# EAGLE design Motorcontroller (EAGLE 9.2.0)
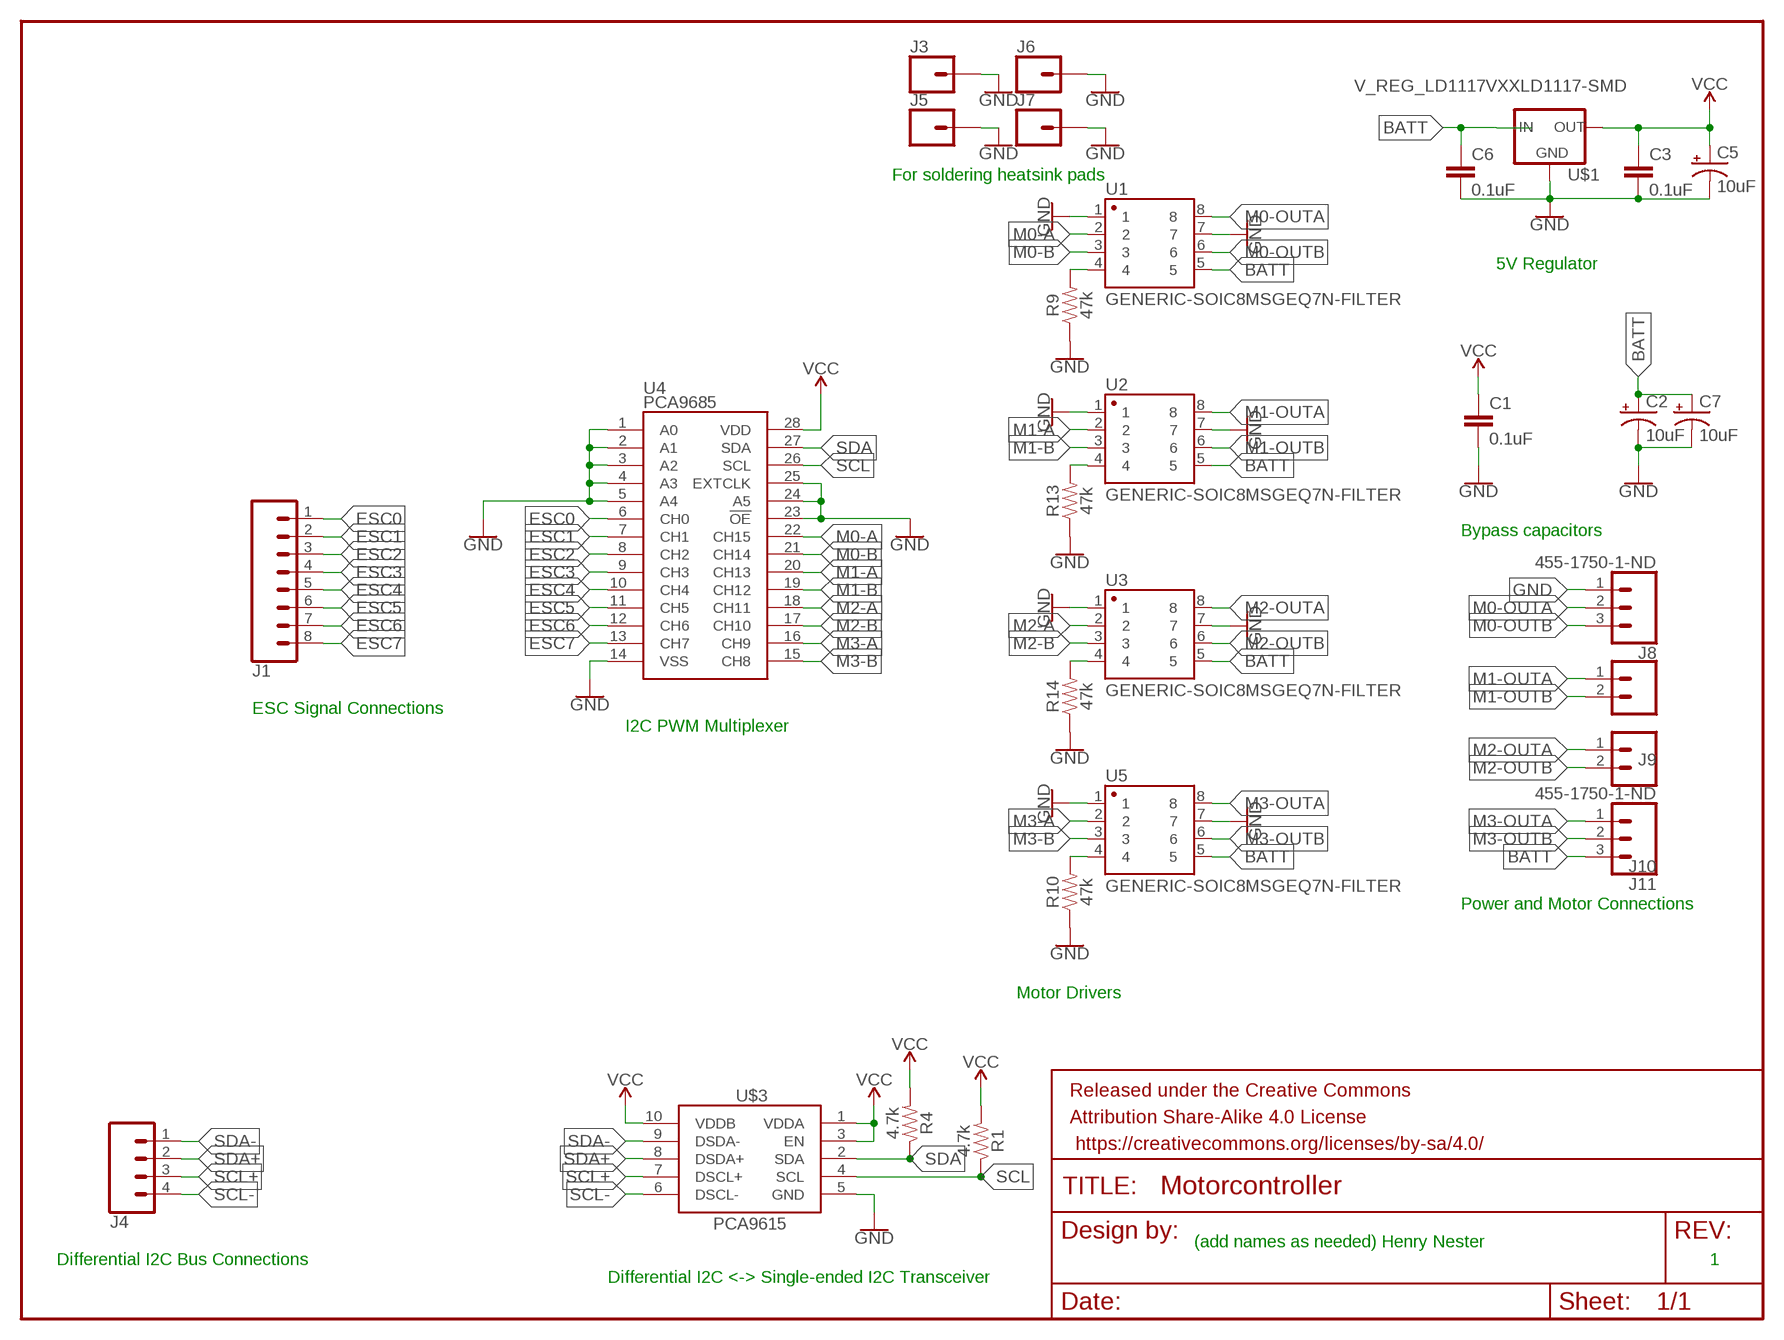
[diagram p0: schematic, sheet 1]

## Parts
C1  0.1uF  0.1UF-0603-25V-(+80/-20%)  [0603]
C2  10uF  10UF-POLAR-RADIAL-2.5MM-25V-20%  [CPOL-RADIAL-2.5MM-5MM]
C3  0.1uF  0.1UF-0603-25V-(+80/-20%)  [0603]
C5  10uF  10UF-POLAR-RADIAL-2.5MM-25V-20%  [CPOL-RADIAL-2.5MM-5MM]
C6  0.1uF  0.1UF-0603-25V-(+80/-20%)  [0603]
C7  10uF  10UF-POLAR-RADIAL-2.5MM-25V-20%  [CPOL-RADIAL-2.5MM-5MM]
FRAME1  FRAME-LETTERNO_PACKAGE  [DUMMY]
J1  CONN_08"  [1X08]
J3  CONN_01PTH_NO_SILK_YES_STOP  [1X01_NO_SILK]
J4  CONN_04  [1X04]
J5  CONN_01PTH_NO_SILK_YES_STOP  [1X01_NO_SILK]
J6  CONN_01PTH_NO_SILK_YES_STOP  [1X01_NO_SILK]
J7  CONN_01PTH_NO_SILK_YES_STOP  [1X01_NO_SILK]
J8  455-1750-1-ND  CONN_03  [1X03]
J9  CONN_02  [1X02]
J10  CONN_02  [1X02]
J11  455-1750-1-ND  CONN_03  [1X03]
R1  4.7k  4.7KOHM-0603-1/10W-1%  [0603]
R4  4.7k  4.7KOHM-0603-1/10W-1%  [0603]
R9  47k  47KOHM-0603-1/10W-1%  [0603]
R10  47k  47KOHM-0603-1/10W-1%  [0603]
R13  47k  47KOHM-0603-1/10W-1%  [0603]
R14  47k  47KOHM-0603-1/10W-1%  [0603]
U1  GENERIC-SOIC8MSGEQ7N-FILTER  [SO08]
U2  GENERIC-SOIC8MSGEQ7N-FILTER  [SO08]
U3  GENERIC-SOIC8MSGEQ7N-FILTER  [SO08]
U4  PCA9685  [TSSOP-28_4MM]
U5  GENERIC-SOIC8MSGEQ7N-FILTER  [SO08]
U$1  V_REG_LD1117VXXLD1117-SMD  [SOT223]
U$3  PCA9615  [TSSOP10]

## Nets
BATT: C2.1(+) C6.1 C7.1(+) J11.3 U1.5 U2.5 U3.5 U5.5 U$1.3(IN)
ESC0: J1.1 U4.6(CH0)
ESC1: J1.2 U4.7(CH1)
ESC2: J1.3 U4.8(CH2)
ESC3: J1.4 U4.9(CH3)
ESC4: J1.5 U4.10(CH4)
ESC5: J1.6 U4.11(CH5)
ESC6: J1.7 U4.12(CH6)
ESC7: J1.8 U4.13(CH7)
GND: C1.2 C2.2(-) C3.2 C5.2(-) C6.2 C7.2(-) J3.1 J5.1 J6.1 J7.1 J8.1 R9.1 R10.1 R13.1 R14.1 U1.1 U1.7 U2.1 U2.7 U3.1 U3.7 U4.1(A0) U4.2(A1) U4.3(A2) U4.4(A3) U4.5(A4) U4.14(VSS) U4.23(!OE) U4.24(A5) U4.25(EXTCLK) U5.1 U5.7 U$1.1(GND) U$3.5(GND)
M0-A: U1.2 U4.22(CH15)
M0-B: U1.3 U4.21(CH14)
M0-OUTA: J8.2 U1.8
M0-OUTB: J8.3 U1.6
M1-A: U2.2 U4.20(CH13)
M1-B: U2.3 U4.19(CH12)
M1-OUTA: J9.1 U2.8
M1-OUTB: J9.2 U2.6
M2-A: U3.2 U4.18(CH11)
M2-B: U3.3 U4.17(CH10)
M2-OUTA: J10.1 U3.8
M2-OUTB: J10.2 U3.6
M3-A: U4.16(CH9) U5.2
M3-B: U4.15(CH8) U5.3
M3-OUTA: J11.1 U5.8
M3-OUTB: J11.2 U5.6
N$1: R13.2 U2.4
N$2: R14.2 U3.4
N$3: R10.2 U5.4
N$7: R9.2 U1.4
SCL: R1.1 U4.26(SCL) U$3.4(SCL)
SCL+: J4.3 U$3.7(DSCL+)
SCL-: J4.4 U$3.6(DSCL-)
SDA: R4.1 U4.27(SDA) U$3.2(SDA)
SDA+: J4.2 U$3.8(DSDA+)
SDA-: J4.1 U$3.9(DSDA-)
VCC: C1.1 C3.1 C5.1(+) R1.2 R4.2 U4.28(VDD) U$1.2(OUT) U$3.1(VDDA) U$3.3(EN) U$3.10(VDDB)

## Notes on the sheet
- For soldering heatsink pads
- 5V Regulator
- Bypass capacitors
- ESC Signal Connections
- I2C PWM Multiplexer
- Power and Motor Connections
- Motor Drivers
- (add names as needed) Henry Nester
- Differential I2C Bus Connections | 1
- Differential I2C <-> Single-ended I2C Transceiver

## Library data of the parts
C1 C3 C6 = SparkFun-Capacitors:0.1UF: 0.1µF ceramic capacitors A capacitor is a passive two-terminal electrical component used to store electrical energy temporarily in an electric field.; PROD_ID: CAP-00810
C2 C5 C7 = SparkFun-Capacitors:10UF-POLAR: 10.0µF polarized capacitors A capacitor is a passive two-terminal electrical component used to store electrical energy temporarily in an electric field.; PROD_ID: CAP-08440
FRAME1 = SparkFun-Aesthetics:FRAME-LETTER: Schematic Frame - Letter Standard 8.5x11 US Letter frame; DESIGNER: Nobody; VERSION: v01
J1 = SparkFun-Connectors:CONN_08: Multi connection point. Often used as Generic Header-pin footprint for 0.1 inch spaced/style header connections On any of the 0.1 inch spaced packages, you can populate with these: Break Away Headers - Straight <https://www.sparkfun.com/products/116> (PRT-00116) Break Away Male Headers - Right Angle <https://www.sparkfun.com/products/553> (PRT-00553) Female Headers <https://www.sparkfun.com/products/115> (PRT-00115) Break Away Headers - Machine Pin <https://www.sparkfun.com/products/117> (PRT-00117) Break Away Female Headers - Swiss Machine Pin <https://www.sparkfun.com/products/743> (PRT-00743) Arduino Stackable Header - 8 Pin <https://www.sparkfun.com/products/9279> (PRT-09279) For SCREWTERMINALS and SPRING TERMINALS visit here: Screw Terimnals on SparkFun.com <https://www.sparkfun.com/search/results?term=Screw+Terminals> (5mm/3.5mm/2.54mm spacing) This device is also useful as a general connection point to wire up your design to another part of your project. Our various solder wires solder well into these plated through hole pads. Hook-Up Wire - Assortment (Stranded, 22 AWG) <https://www.sparkfun.com/products/11375> (PRT-11375) Hook-Up Wire - Assortment (Solid Core, 22 AWG) <https://www.sparkfun.com/products/11367> (PRT-11367) View the entire wire category on our website here <https://www.sparkfun.com/categories/141> Special notes: Molex polarized connector foot print use with SKU : PRT-08231 with associated crimp pins and housings. 1MM SMD Version SKU: PRT-10208 NOTES ON THE VARIANTS LOCK and LOCK_LONGPADS... This footprint was designed to help hold the alignment of a through-hole component (i.e. 6-pin header) while soldering it into place. You may notice that each hole has been shifted either up or down by 0.005 of an inch from it's more standard position (which is a perfectly straight line). This slight alteration caused the pins (the squares in the middle) to touch the edges of the holes. Because they are alternating, it causes a "brace" to hold the component in place. 0.005 has proven to be the perfect amount of "off-center" position when using our standard breakaway headers. Although looks a little odd when you look at the bare footprint, once you have a header in there, the alteration is very hard to notice. Also,if you push a header all the way into place, it is covered up entirely on the bottom side.; PROD_ID: CONN-08438
J3 J5-J7 = SparkFun-Connectors:CONN_01: Single connection point. Often used as Generic Header-pin footprint for 0.1 inch spaced/style header connections On any of the 0.1 inch spaced packages, you can populate with these: Break Away Headers - Straight <https://www.sparkfun.com/products/116> (PRT-00116) Break Away Male Headers - Right Angle <https://www.sparkfun.com/products/553> (PRT-00553) Female Headers <https://www.sparkfun.com/products/115> (PRT-00115) Break Away Headers - Machine Pin <https://www.sparkfun.com/products/117> (PRT-00117) Break Away Female Headers - Swiss Machine Pin <https://www.sparkfun.com/products/743> (PRT-00743) This device is also useful as a general connection point to wire up your design to another part of your project. Our various solder wires solder well into these plated through hole pads. Hook-Up Wire - Assortment (Stranded, 22 AWG) <https://www.sparkfun.com/products/11375> (PRT-11375) Hook-Up Wire - Assortment (Solid Core, 22 AWG) <https://www.sparkfun.com/products/11367> (PRT-11367) View the entire wire category on our website here <https://www.sparkfun.com/categories/141> Special notes: SMTSO-256-ET is a "flush mount" nut for a 4-40 screw. We mostly use this on specialty testbeds; it is a nice way to connect hardware to your PCB at an adjustable hieght. Also note, the SNAP packages are for using a snappable style connector. We sell a baggie of snaps and they are also used on two LilyPad designs: Snap Assortment - 30 pack (male and female) <https://www.sparkfun.com/products/11347> (DEV-11347) LilyPad Arduino SimpleSnap <https://www.sparkfun.com/products/10941> (DEV-10941) LilyPad SimpleSnap Protoboard <https://www.sparkfun.com/products/10940> (DEV-10940)
J4 = SparkFun-Connectors:CONN_04: Multi connection point. Often used as Generic Header-pin footprint for 0.1 inch spaced/style header connections On any of the 0.1 inch spaced packages, you can populate with these: Break Away Headers - Straight <https://www.sparkfun.com/products/116> (PRT-00116) Break Away Male Headers - Right Angle <https://www.sparkfun.com/products/553> (PRT-00553) Female Headers <https://www.sparkfun.com/products/115> (PRT-00115) Break Away Headers - Machine Pin <https://www.sparkfun.com/products/117> (PRT-00117) Break Away Female Headers - Swiss Machine Pin <https://www.sparkfun.com/products/743> (PRT-00743) For SCREWTERMINALS and SPRING TERMINALS visit here: Screw Terimnals on SparkFun.com <https://www.sparkfun.com/search/results?term=Screw+Terminals> (5mm/3.5mm/2.54mm spacing) This device is also useful as a general connection point to wire up your design to another part of your project. Our various solder wires solder well into these plated through hole pads. Hook-Up Wire - Assortment (Stranded, 22 AWG) <https://www.sparkfun.com/products/11375> (PRT-11375) Hook-Up Wire - Assortment (Solid Core, 22 AWG) <https://www.sparkfun.com/products/11367> (PRT-11367) View the entire wire category on our website here <https://www.sparkfun.com/categories/141> Special notes: Molex polarized connector foot print use with SKU : PRT-08231 with associated crimp pins and housings. 1MM SMD Version SKU: PRT-10208; PROD_ID: CONN-09696
J8 J11 = SparkFun-Connectors:CONN_03: Multi connection point. Often used as Generic Header-pin footprint for 0.1 inch spaced/style header connections On any of the 0.1 inch spaced packages, you can populate with these: Break Away Headers - Straight <https://www.sparkfun.com/products/116> (PRT-00116) Break Away Male Headers - Right Angle <https://www.sparkfun.com/products/553> (PRT-00553) Female Headers <https://www.sparkfun.com/products/115> (PRT-00115) Break Away Headers - Machine Pin <https://www.sparkfun.com/products/117> (PRT-00117) Break Away Female Headers - Swiss Machine Pin <https://www.sparkfun.com/products/743> (PRT-00743) Stackable Header - 3 Pin (Female, 0.1") <https://www.sparkfun.com/products/13875> (PRT-13875) For SCREWTERMINALS and SPRING TERMINALS visit here: Screw Terimnals on SparkFun.com <https://www.sparkfun.com/search/results?term=Screw+Terminals> (5mm/3.5mm/2.54mm spacing) This device is also useful as a general connection point to wire up your design to another part of your project. Our various solder wires solder well into these plated through hole pads. Hook-Up Wire - Assortment (Stranded, 22 AWG) <https://www.sparkfun.com/products/11375> (PRT-11375) Hook-Up Wire - Assortment (Solid Core, 22 AWG) <https://www.sparkfun.com/products/11367> (PRT-11367) View the entire wire category on our website here <https://www.sparkfun.com/categories/141> Special notes: Molex polarized connector foot print use with SKU : PRT-08232 with associated crimp pins and housings.; PROD_ID: XXX-00000
J9 J10 = SparkFun-Connectors:CONN_02: Multi connection point. Often used as Generic Header-pin footprint for 0.1 inch spaced/style header connections On any of the 0.1 inch spaced packages, you can populate with these: Break Away Headers - Straight <https://www.sparkfun.com/products/116> (PRT-00116) Break Away Male Headers - Right Angle <https://www.sparkfun.com/products/553> (PRT-00553) Female Headers <https://www.sparkfun.com/products/115> (PRT-00115) Break Away Headers - Machine Pin <https://www.sparkfun.com/products/117> (PRT-00117) Break Away Female Headers - Swiss Machine Pin <https://www.sparkfun.com/products/743> (PRT-00743) For SCREWTERMINALS and SPRING TERMINALS visit here: Screw Terimnals on SparkFun.com <https://www.sparkfun.com/search/results?term=Screw+Terminals> (5mm/3.5mm/2.54mm spacing) This device is also useful as a general connection point to wire up your design to another part of your project. Our various solder wires solder well into these plated through hole pads. Hook-Up Wire - Assortment (Stranded, 22 AWG) <https://www.sparkfun.com/products/11375> (PRT-11375) Hook-Up Wire - Assortment (Solid Core, 22 AWG) <https://www.sparkfun.com/products/11367> (PRT-11367) View the entire wire category on our website here <https://www.sparkfun.com/categories/141> Special notes: Molex polarized connector foot print use with: PRT-08233 with associated crimp pins and housings. 2.54_SCREWTERM for use with PRT-10571. 3.5mm Screw Terminal footprints for PRT-08084 5mm Screw Terminal footprints for use with PRT-08432
R1 R4 = SparkFun-Resistors:4.7KOHM: 4.7kΩ resistor A resistor is a passive two-terminal electrical component that implements electrical resistance as a circuit element. Resistors act to reduce current flow, and, at the same time, act to lower voltage levels within circuits. - Wikipedia; PROD_ID: RES-07857
R9 R10 R13 R14 = SparkFun-Resistors:47KOHM: 47kΩ resistor A resistor is a passive two-terminal electrical component that implements electrical resistance as a circuit element. Resistors act to reduce current flow, and, at the same time, act to lower voltage levels within circuits. - Wikipedia; PROD_ID: RES-07871
U1-U3 U5 = SparkFun-Retired:GENERIC-SOIC8: A placeholder for generic narrow & wide SOIC8 foorptints - used on the DIP adapter board. Has strange reference to IC-10141, a Seven Band Graphic Equalizer Display Filter SOIC-8 VFP: IC-10141; PROD_ID: IC-10141
U4 = SparkFun-IC-Special-Function:PCA9685: 16-channel 12-bit PWM I2C interface Internal Oscillator 40Hz to 1kHz Can be totem pole or open collector 2.3V to 5.5V SparkFun Products SparkFun Block for Intel® Edison - PWM <https://www.sparkfun.com/products/13042> (DEV-13042) PROTO: IC-12240 PROD_ID: IC-12271; PROD_ID: IC-12271
U$1 = SparkFun-IC-Power:V_REG_LD1117VXX: LD1117VXX voltage regulator. We carry the 3.3V version (COM-00526) in TO-220 package.; PROD_ID: VREG-13917
U$3 = SparkFun-IC-Comms:PCA9615: Differential I2C Bus Buffer Datasheet <https://www.nxp.com/docs/en/data-sheet/PCA9615.pdf>; PROD_ID: IC-13899

## Board
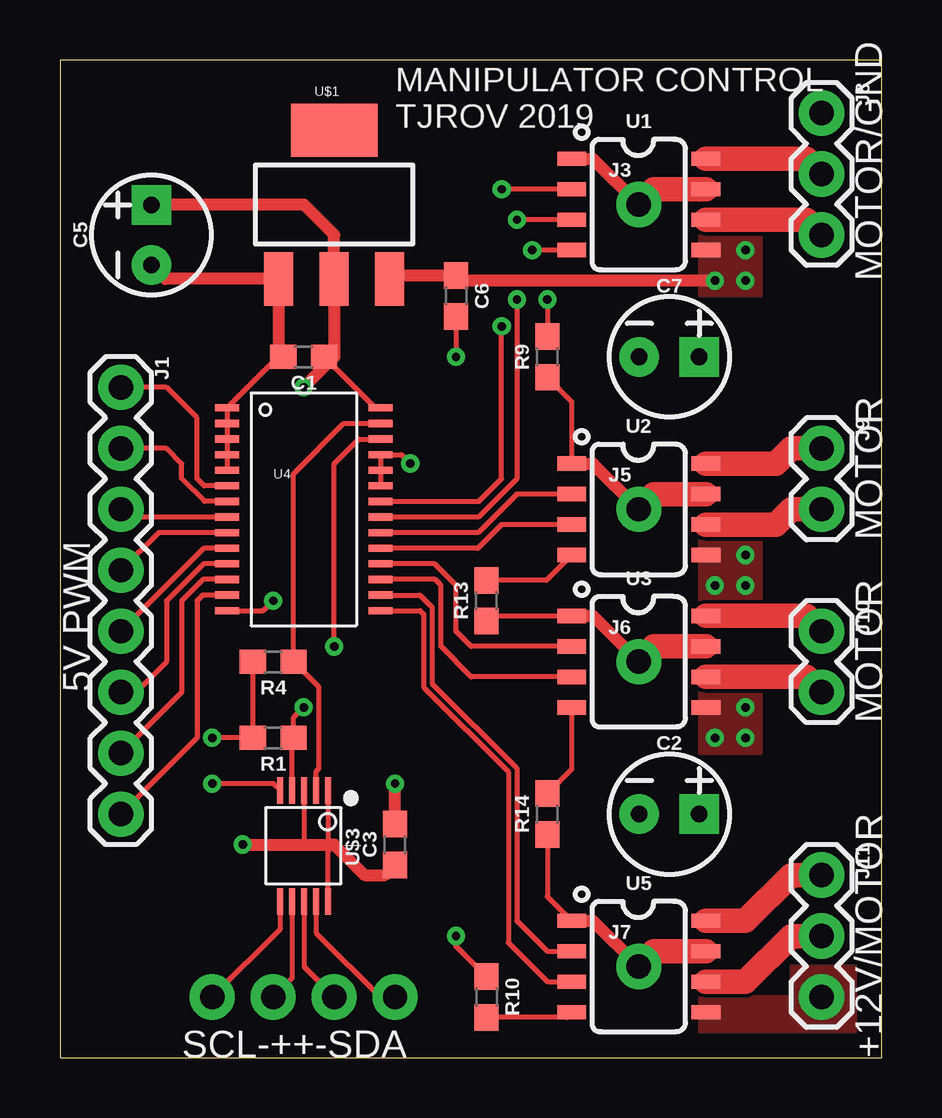
[diagram p1: board, top side]
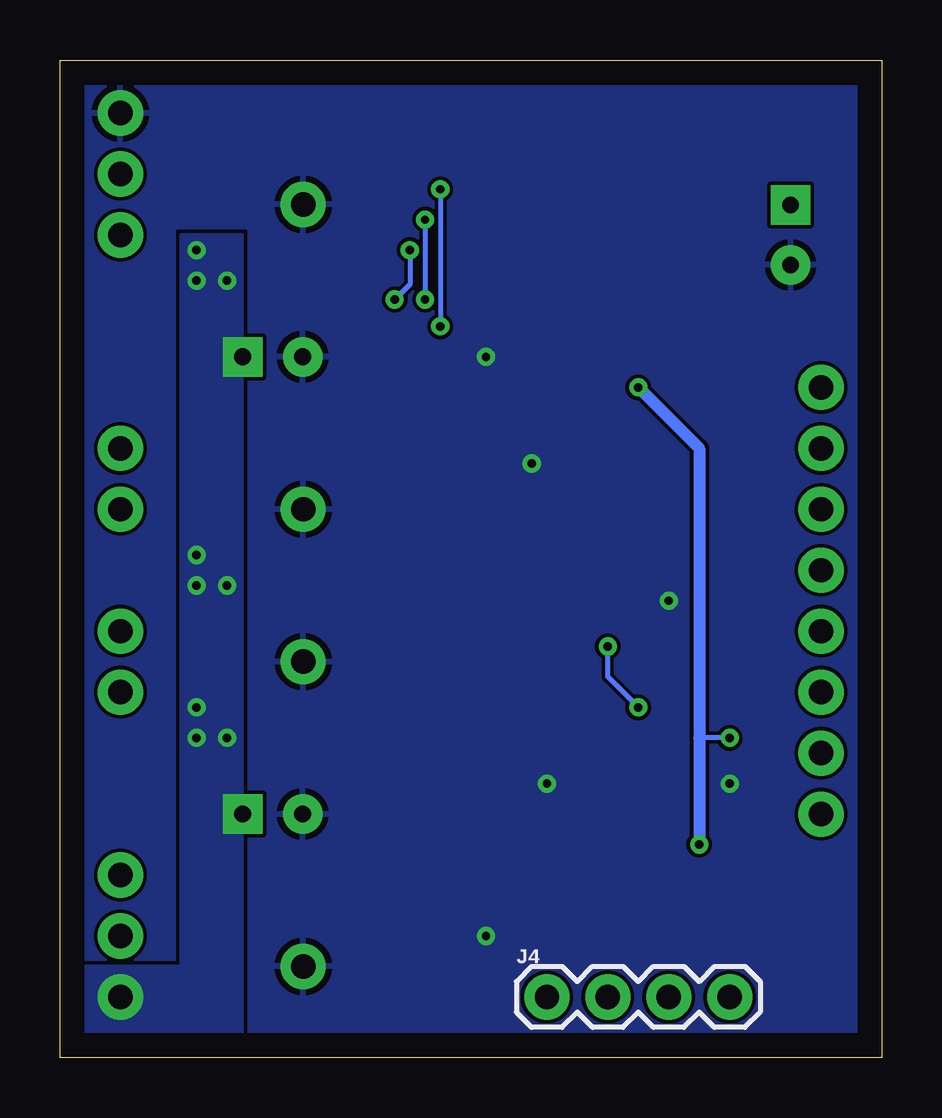
[diagram p2: board, bottom side, seen from below]

Size 34.27 x 41.58 mm. Coordinates in mm from the lower left corner, seen from the top.
Outline: 0,0 34.27,0 34.27,41.58 0,41.58 0,0
Copper layers (1*16): Top 0.035mm / dielectric 1.5mm / Bottom 0.035mm
Design rules "default": minimum track width 6mil, minimum drill 0.35mm, track to track 6mil, track to pad 6mil, pad to pad 6mil, via to via 6mil, smd to smd 6mil, copper to edge 40mil, drill to drill 6mil, minimum pad ring 10mil, minimum via ring 8mil, stop-mask expansion 4mil, vias tented up to drill 0mil, thermal gap 10mil

### Footprints (pad centres in the part's own frame; a part is rotated, then mirrored left to right if it is on the bottom)
0603 = smd 1.1 x 1: 1 -0.85,0; 2 0.85,0
CPOL-RADIAL-2.5MM-5MM = drill 0.7 pad 1.651 square: 1 1.25,0 | drill 0.7 pad 1.651: 2 -1.25,0
1X08 = drill 1.016 pad 1.88: 1 0,0; 2 2.54,0; 3 5.08,0; 4 7.62,0; 5 10.16,0; 6 12.7,0; 7 15.24,0; 8 17.78,0
1X01_NO_SILK = drill 1.016 pad 1.88: 1 0,0
1X04 = drill 1.016 pad 1.88: 1 0,0; 2 2.54,0; 3 5.08,0; 4 7.62,0
1X03 = drill 1.016 pad 1.88: 1 0,0; 2 2.54,0; 3 5.08,0
1X02 = drill 1.016 pad 1.88: 1 0,0; 2 2.54,0
SO08 = smd 0.6 x 1.2: 1 -1.905,-2.8; 2 -0.635,-2.8; 3 0.635,-2.8; 4 1.905,-2.8; 5 1.905,2.8; 6 0.635,2.8; 7 -0.635,2.8; 8 -1.905,2.8
TSSOP-28_4MM = smd 1 x 0.3: 1 -3.2,4.225; 2 -3.2,3.575; 3 -3.2,2.925; 4 -3.2,2.275; 5 -3.2,1.625; 6 -3.2,0.975; 7 -3.2,0.325; 8 -3.2,-0.325; 9 -3.2,-0.975; 10 -3.2,-1.625; 11 -3.2,-2.275; 12 -3.2,-2.925; 13 -3.2,-3.575; 14 -3.2,-4.225; 15 3.2,-4.225; 16 3.2,-3.575; 17 3.2,-2.925; 18 3.2,-2.275; 19 3.2,-1.625; 20 3.2,-0.975; 21 3.2,-0.325; 22 3.2,0.325; 23 3.2,0.975; 24 3.2,1.625; 25 3.2,2.275; 26 3.2,2.925; 27 3.2,3.575; 28 3.2,4.225
SOT223 = smd 1.219 x 2.235: 1 -2.311,-3.099; 2 0,-3.099; 3 2.311,-3.099 | smd 3.6 x 2.2: 4 0,3.099
TSSOP10 = smd 1.1 x 0.25: 1 -2.259,1.018; 2 -2.259,0.517; 3 -2.259,0.018; 4 -2.259,-0.482; 5 -2.259,-0.988; 6 2.366,-0.988; 7 2.366,-0.482; 8 2.366,0.018; 9 2.366,0.517; 10 2.366,1.018

### Placement (x,y rotation side)
C1  10.16,29.21 180 top
C2  25.4,10.16 0 top
C3  13.97,8.89 90 top
C5  3.81,34.29 90 top
C6  16.51,31.75 270 top
C7  25.4,29.21 0 top
FRAME1  0,0 0 top
J1  2.54,27.94 270 top
J3  24.13,35.56 0 top
J4  13.97,2.54 0 bottom
J5  24.13,22.86 0 top
J6  24.13,16.51 0 top
J7  24.13,3.81 0 top
J8  31.75,39.37 270 top
J9  31.75,25.4 270 top
J10  31.75,17.78 270 top
J11  31.75,7.62 270 top
R1  8.89,13.34 180 top
R4  8.89,16.51 180 top
R9  20.32,29.21 90 top
R10  17.78,2.54 270 top
R13  17.78,19.05 90 top
R14  20.32,10.16 90 top
U1  24.13,35.56 270 top
U2  24.13,22.86 270 top
U3  24.13,16.51 270 top
U4  10.16,22.86 0 top
U5  24.13,3.81 270 top
U$1  11.43,35.56 0 top
U$3  10.16,8.89 270 top

### Tracks (layer width: path | path; a pad name or v marks a point on that pad's centre or on a via)
BATT  (via drill 0.35)
  Top 0.508: v27.3,32.38 16.73,32.38 C6.1 13.88,32.6 U$1.3
  other vias: 27.3,13.34 28.57,13.34 28.57,14.61 27.3,19.68 28.57,19.68 28.57,20.95 28.57,32.38 28.57,33.66
  pour Top (no thermals): 26.67,34.29 26.67,31.75 29.21,31.75 29.21,34.29
  pour Top (no thermals): 26.67,21.59 26.67,19.05 29.21,19.05 29.21,21.59
  pour Top (no thermals): 26.67,15.24 26.67,12.7 29.21,12.7 29.21,15.24
  pour Bottom (no thermals): 26.67,0 34.29,0 34.29,3.81 29.21,3.81 29.21,34.29 26.67,34.29
  pour Top (no thermals): 26.67,2.54 29.21,2.54 30.48,2.54 30.48,3.81 33.02,3.81 34.29,3.81 34.29,0 26.67,0
ESC0
  Top 0.203: U4.6 6.01,23.84 5.71,24.13 5.71,26.67 4.45,27.94 J1.1
ESC1
  Top 0.203: U4.7 6.03,23.18 5.08,24.13 5.08,24.77 4.45,25.4 J1.2
ESC2
  Top 0.203: U4.8 2.87,22.54 J1.3
ESC3
  Top 0.203: U4.9 4.11,21.89 J1.4
ESC4
  Top 0.203: U4.10 6,21.23 J1.5
ESC5
  Top 0.203: U4.11 5.98,20.59 4.45,19.05 4.45,16.51 3.17,15.24 J1.6
ESC6
  Top 0.203: U4.12 5.96,19.93 5.08,19.05 5.08,15.24 J1.7
ESC7
  Top 0.203: U4.13 5.95,19.29 5.71,19.05 5.71,13.34 J1.8
GND  (via drill 0.35)
  Top 0.203: U$3.5 8.89,11.43 v6.35,11.43 | C1.2 9.09,29.21 U4.1 U4.2 U4.3 U4.4 U4.5 | U4.23 U4.24 U4.25 14.23,25.14 v14.61,24.77 | U4.14 8.47,18.64 v8.89,19.05 | C6.2 v16.51,29.21 | R9.1 21.33,27.35 U2.1 | R13.1 18,18.41 U3.1 | R14.1 20.32,6.72 U5.1 | R10.1 16.51,4.66 v16.51,5.08
  Top 0.508: U1.1 22.23,37.47 J3.1 | U2.1 22.23,24.77 J5.1 | U3.1 22.23,18.41 J6.1 | U5.1 22.23,5.71 J7.1 | C1.2 9.12,29.4 U$1.1 4.39,32.46 C5.2 | C3.2 v13.97,11.43
  Top 1.016: U1.7 24.77,36.2 J3.1 | U2.7 24.77,23.5 J5.1 | U3.7 24.77,17.14 J6.1 | U5.7 24.77,4.45 J7.1
  pour Bottom (rank 2): -6.35,44.45 40.64,44.45 40.64,-3.81 -6.35,-3.81
M0-A  (via drill 0.35)
  Top 0.203: U1.2 v18.41,36.2 | v18.41,30.48 18.41,24.13 17.47,23.18 U4.22
  Bottom 0.203: v18.41,36.2 v18.41,30.48
M0-B  (via drill 0.35)
  Top 0.203: U1.3 v19.05,34.92 | v19.05,31.6 19.05,24.13 17.45,22.54 U4.21
  Bottom 0.203: v19.05,34.92 v19.05,31.6
M0-OUTA
  Top 1.016: U1.8 31.11,37.47 J8.2
M0-OUTB
  Top 1.016: U1.6 31.11,34.92 J8.3
M1-A
  Top 0.203: U2.2 19.05,23.5 17.44,21.89 U4.20
M1-B
  Top 0.203: U4.19 17.43,21.23 18.41,22.23 U2.3
M1-OUTA
  Top 1.016: U2.8 29.84,24.77 30.48,25.4 J9.1
M1-OUTB
  Top 1.016: U2.6 29.84,22.23 30.48,22.86 J9.2
M2-A
  Top 0.203: U3.2 17.14,17.14 16.51,17.78 16.51,19.68 15.61,20.59 U4.18
M2-B
  Top 0.203: U3.3 17.14,15.88 15.88,17.14 15.88,19.68 15.62,19.93 U4.17
M2-OUTA
  Top 1.016: U3.8 31.11,18.41 J10.1
M2-OUTB
  Top 1.016: U3.6 31.11,15.88 J10.2
M3-A
  Top 0.203: U4.16 15.01,19.29 15.52,18.77 15.52,15.6 19.05,12.06 19.05,5.71 20.32,4.45 U5.2
M3-B
  Top 0.203: U4.15 15.02,18.64 15.16,18.49 15.16,15.45 18.69,11.92 18.69,4.8 20.32,3.17 U5.3
M3-OUTA
  Top 1.016: U5.8 28.57,5.71 30.48,7.62 J11.1
M3-OUTB
  Top 1.016: U5.6 28.57,3.17 30.48,5.08 J11.2
N$1
  Top 0.203: U2.4 20.27,19.9 R13.2
N$2
  Top 0.203: U3.4 21.33,12.02 R14.2
N$3
  Top 0.203: U5.4 21.11,1.69 R10.2
N$7  (via drill 0.35)
  Top 0.203: U1.4 v19.68,33.66 | v20.32,31.6 R9.2
  Bottom 0.203: v19.68,33.66 19.68,32.23 v20.32,31.6
SCL  (via drill 0.35)
  Top 0.203: U$3.4 9.68,13.27 R1.1 9.74,14.19 v10.16,14.61 | v11.43,17.14 11.43,24.77 12.45,25.79 U4.26
  Bottom 0.203: v10.16,14.61 11.43,15.88 v11.43,17.14
SCL+
  Top 0.203: U$3.7 9.68,3.33 J4.3
SCL-
  Top 0.203: U$3.6 9.17,5.36 J4.4
SDA
  Top 0.203: U$3.2 10.68,11.95 10.79,12.06 10.79,15.46 R4.1 9.74,24.34 11.83,26.43 U4.27
SDA+
  Top 0.203: U$3.8 10.18,3.79 J4.2
SDA-
  Top 0.203: U$3.9 10.68,5.2 13.34,2.54 J4.1
VCC  (via drill 0.35)
  Top 0.203: U$3.1 11.18,9.14 11.43,8.89 11.18,8.64 U$3.10 | U$3.3 10.18,8.91 10.16,8.89 | C1.1 13.13,27.09 U4.28 | R4.2 R1.2 v6.35,13.34
  Top 0.508: v10.16,27.94 11.01,28.79 C1.1 11.43,29.21 U$1.2 11.43,34.29 10.16,35.56 10.14,35.54 C5.1 | v7.62,8.89 10.16,8.89 11.43,8.89 12.7,7.62 13.55,7.62 C3.1
  Bottom 0.203: v6.35,13.34 7.62,13.34
  Bottom 0.508: v10.16,27.94 7.62,25.4 7.62,13.34 v7.62,8.89

### Text on the board
tPlace: MANIPULATOR CONTROL / TJROV 2019 | MOTOR/GND | MOTOR | 5V PWM | MOTOR | SCL-++-SDA | +12V/MOTOR